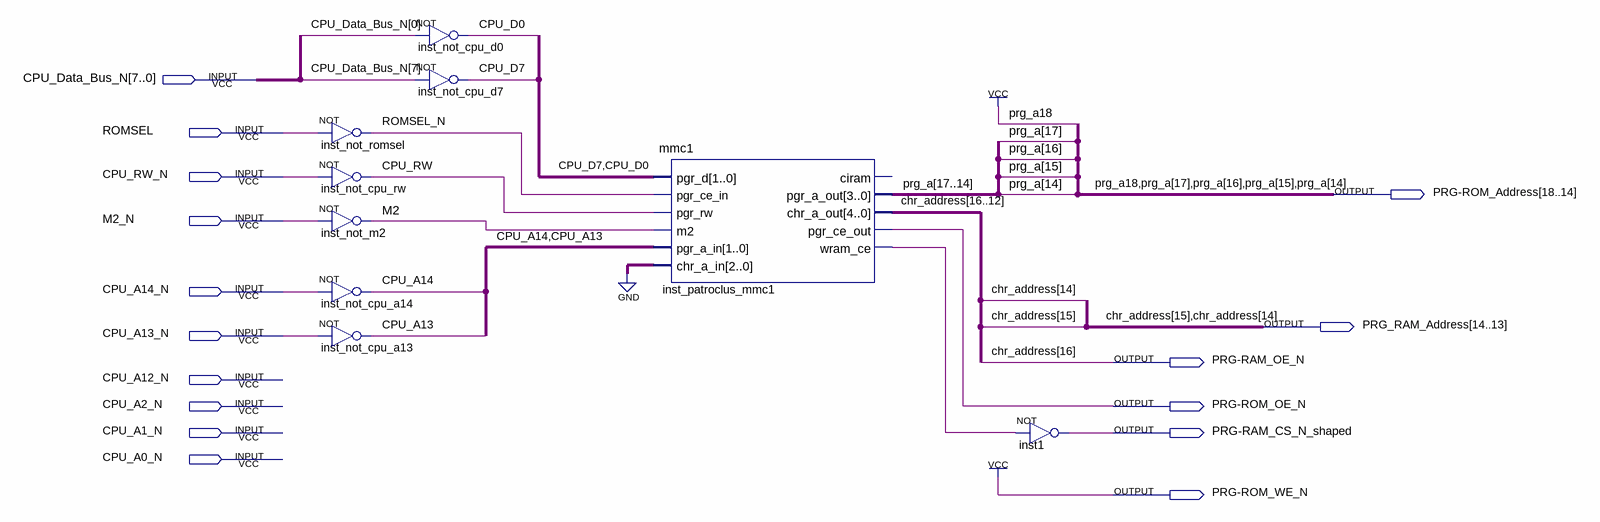
[diagram p0: schematic sheet]
// Quartus schematic patroclus-mmc1.bdf as structural Verilog: 9 symbols, 16 pins
module \patroclus-mmc1  (
  input  [7:0] CPU_Data_Bus_N,
  input  ROMSEL,
  input  CPU_RW_N,
  input  M2_N,
  input  CPU_A14_N,
  input  CPU_A13_N,
  input  CPU_A12_N,
  input  CPU_A2_N,
  input  CPU_A1_N,
  input  CPU_A0_N,
  output [18:14] \PRG-ROM_Address ,
  output [14:13] PRG_RAM_Address,
  output \PRG-RAM_OE_N ,
  output \PRG-ROM_OE_N ,
  output \PRG-RAM_CS_N_shaped ,
  output \PRG-ROM_WE_N 
);

  wire CPU_A13, CPU_A14, CPU_D0, CPU_D7, CPU_RW, inst_patroclus_mmc1_wram_ce, M2, ROMSEL_N;
  wire [13:12] chr_address;

  not inst_not_romsel (ROMSEL_N, ROMSEL);
  not inst_not_cpu_rw (CPU_RW, CPU_RW_N);
  not inst_not_m2 (M2, M2_N);
  not inst_not_cpu_a14 (CPU_A14, CPU_A14_N);
  not inst_not_cpu_a13 (CPU_A13, CPU_A13_N);
  not inst_not_cpu_d0 (CPU_D0, CPU_Data_Bus_N[0]);
  not inst_not_cpu_d7 (CPU_D7, CPU_Data_Bus_N[7]);
  mmc1 inst_patroclus_mmc1 (
    .pgr_d({CPU_D7, CPU_D0}), .pgr_ce_in(ROMSEL_N), .pgr_rw(CPU_RW), .m2(M2), .pgr_a_in({CPU_A14, CPU_A13}),
    .chr_a_in(3'b000), .pgr_a_out(\PRG-ROM_Address [17:14]),
    .chr_a_out({\PRG-RAM_OE_N , PRG_RAM_Address, chr_address}), .pgr_ce_out(\PRG-ROM_OE_N ),
    .wram_ce(inst_patroclus_mmc1_wram_ce));  // open: ciram
  not inst1 (\PRG-RAM_CS_N_shaped , inst_patroclus_mmc1_wram_ce);

  assign \PRG-ROM_Address [18] = 1'b1;
  assign \PRG-ROM_WE_N  = 1'b1;

  // Other names for the same wires on the sheet: chr_address[16:14] = {\PRG-RAM_OE_N , PRG_RAM_Address};
  //   prg_a[17:14] = \PRG-ROM_Address [17:14]
endmodule
